# Altium schematic sheet ProteccionesCPLD.SchDoc
size A4
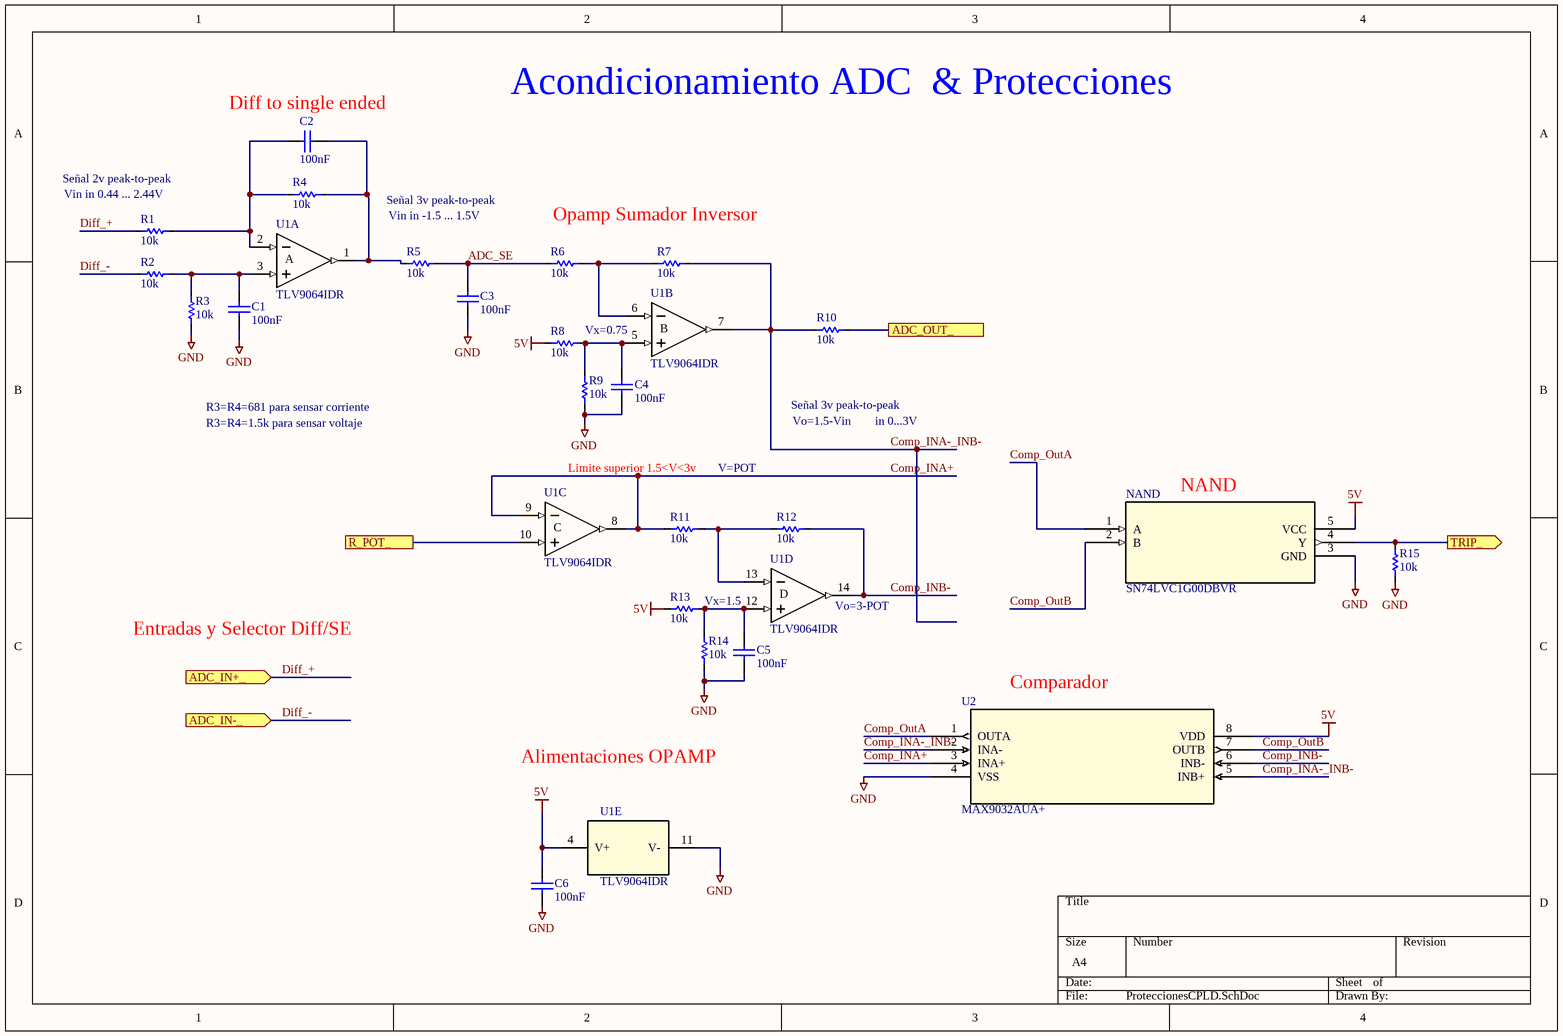
[diagram p0: ProteccionesCPLD.SchDoc]

## Parts
C1  100nF  [CAP_0603]
C2  100nF  [CAP_0603]
C3  100nF  [CAP_0603]
C4  100nF  [CAP_0603]
C5  100nF  [CAP_0603]
C6  100nF  [CAP_0603]
NAND  SN74LVC1G00DBVR  [DBV5-M]
R1  10k  [RES_0603]
R2  10k  [RES_0603]
R3  10k  [RES_0603]
R4  10k  [RES_0603]
R5  10k  [RES_0603]
R6  10k  [RES_0603]
R7  10k  [RES_0603]
R8  10k  [RES_0603]
R9  10k  [RES_0603]
R10  10k  [RES_0603]
R11  10k  [RES_0603]
R12  10k  [RES_0603]
R13  10k  [RES_0603]
R14  10k  [RES_0603]
R15  10k  [RES_0603]
U1  TLV9064IDR  [D0014A_N]  (parts A,B,C,D,E of 5)
U2  MAX9032AUA+  [21-0036K-M]

## Ports
ADC_IN+_ (in), ADC_IN-_ (in), ADC_OUT_, R_POT_, TRIP_ (out)

## Nets
5V: C6.1 NAND.5(VCC) R8.2 R13.2 U1.4(V+) U2.8(VDD)
GND: C1.2 C3.2 C4.2 C5.2 C6.2 NAND.3(GND) R3.2 R9.1 R14.1 R15.1 U1.11(V-) U2.4(VSS)
ADC_OUT_: R10.1 ; port ADC_OUT_
ADC_SE: C3.1 R5.2 R6.1
Comp_INA+: R11.1 U1.8(OUT) U1.9(IN-) U2.3(INA+)
Comp_INA-_INB-: R7.1 R10.2 U1.7(OUT) U2.2(INA-) U2.5(INB+)
Comp_INB-: R12.1 U1.14(OUT) U2.6(INB-)
Comp_OutA: NAND.1(A) U2.1(OUTA)
Comp_OutB: NAND.2(B) U2.7(OUTB)
Diff_+: R1.1 ; port ADC_IN+_
Diff_-: R2.1 ; port ADC_IN-_
R_POT_: U1.10(IN+) ; port R_POT_
TRIP_: NAND.4(Y) R15.2 ; port TRIP_
NetC1_1: C1.1 R2.2 R3.1 U1.3(IN+)
NetC2_1: C2.1 R1.2 R4.1 U1.2(IN-)
NetC2_2: C2.2 R4.2 R5.1 U1.1(OUT)
NetC4_1: C4.1 R8.1 R9.2 U1.5(IN+)
NetC5_1: C5.1 R13.1 R14.2 U1.12(IN+)
NetR6_2: R6.2 R7.2 U1.6(IN-)
NetR11_2: R11.2 R12.2 U1.13(IN-)

## Notes on the sheet
- (near C2) Diff to single ended
- Acondicionamiento ADC  & Protecciones
- (near R1) Señal 2v peak-to-peak
- (near R1) Vin in 0.44 ... 2.44V
- Señal 3v peak-to-peak
- Vin in -1.5 ... 1.5V
- Opamp Sumador Inversor
- (near R8) Vx=0.75
- R3=R4=681 para sensar corriente
- R3=R4=1.5k para sensar voltaje
- Vo=1.5-Vin        in 0...3V
- Limite superior 1.5<V<3v
- V=POT
- (near NAND) NAND
- Entradas y Selector Diff/SE
- (near R13) Vx=1.5
- (near U1) Vo=3-POT
- (near U2) Comparador
- Alimentaciones OPAMP
- (in symbol TLV9064IDR, part A) A
- (in symbol TLV9064IDR, part B) B
- (in symbol TLV9064IDR, part C) C
- (in symbol TLV9064IDR, part D) D

## Library data of the parts
C1-C6 = Cap_0603: 0.1µF ±10% 50V Ceramic Capacitor X7R 0603 (1608 Metric); MF: KEMET; MFP: C0603C104K5RACTU; Created: 2020_06_15_DAarancibia; Package: 0603; Value: 100nF; Supplier 1: Digi-Key; Supplier Part Number 1: 399-5089-1-ND
NAND = SN74LVC1G00DBVR: No Description Available; Mfr_Name: Texas Instruments; RefDes: RefDes; Type: Type
R1-R15 = Res_0603: 10 kOhms ±1% 0.1W, 1/10W Chip Resistor 0402 (1005 Metric) Anti-Sulfur, Automotive AEC-Q200 Thick Film; MF: Panasonic Electronic Components; MFP: ERJ-3EKF1002V; Created: 2020_06_15_DAarancibia; Package: 0603; Value: 10k; Supplier 1: Digi-Key; Supplier Part Number 1: P10.0KHCT-ND
U1 = TLV9064IDR: No Description Available; Mfr_Name: Texas Instruments; TYPE: TYPE; RefDes: RefDes
U2 = MAX9032AUA+: No Description Available; Mfr_Name: Analog Devices Inc; RefDes: RefDes; Type: Type